# EAGLE schematic atmega32u4_robor (EAGLE 6.3)
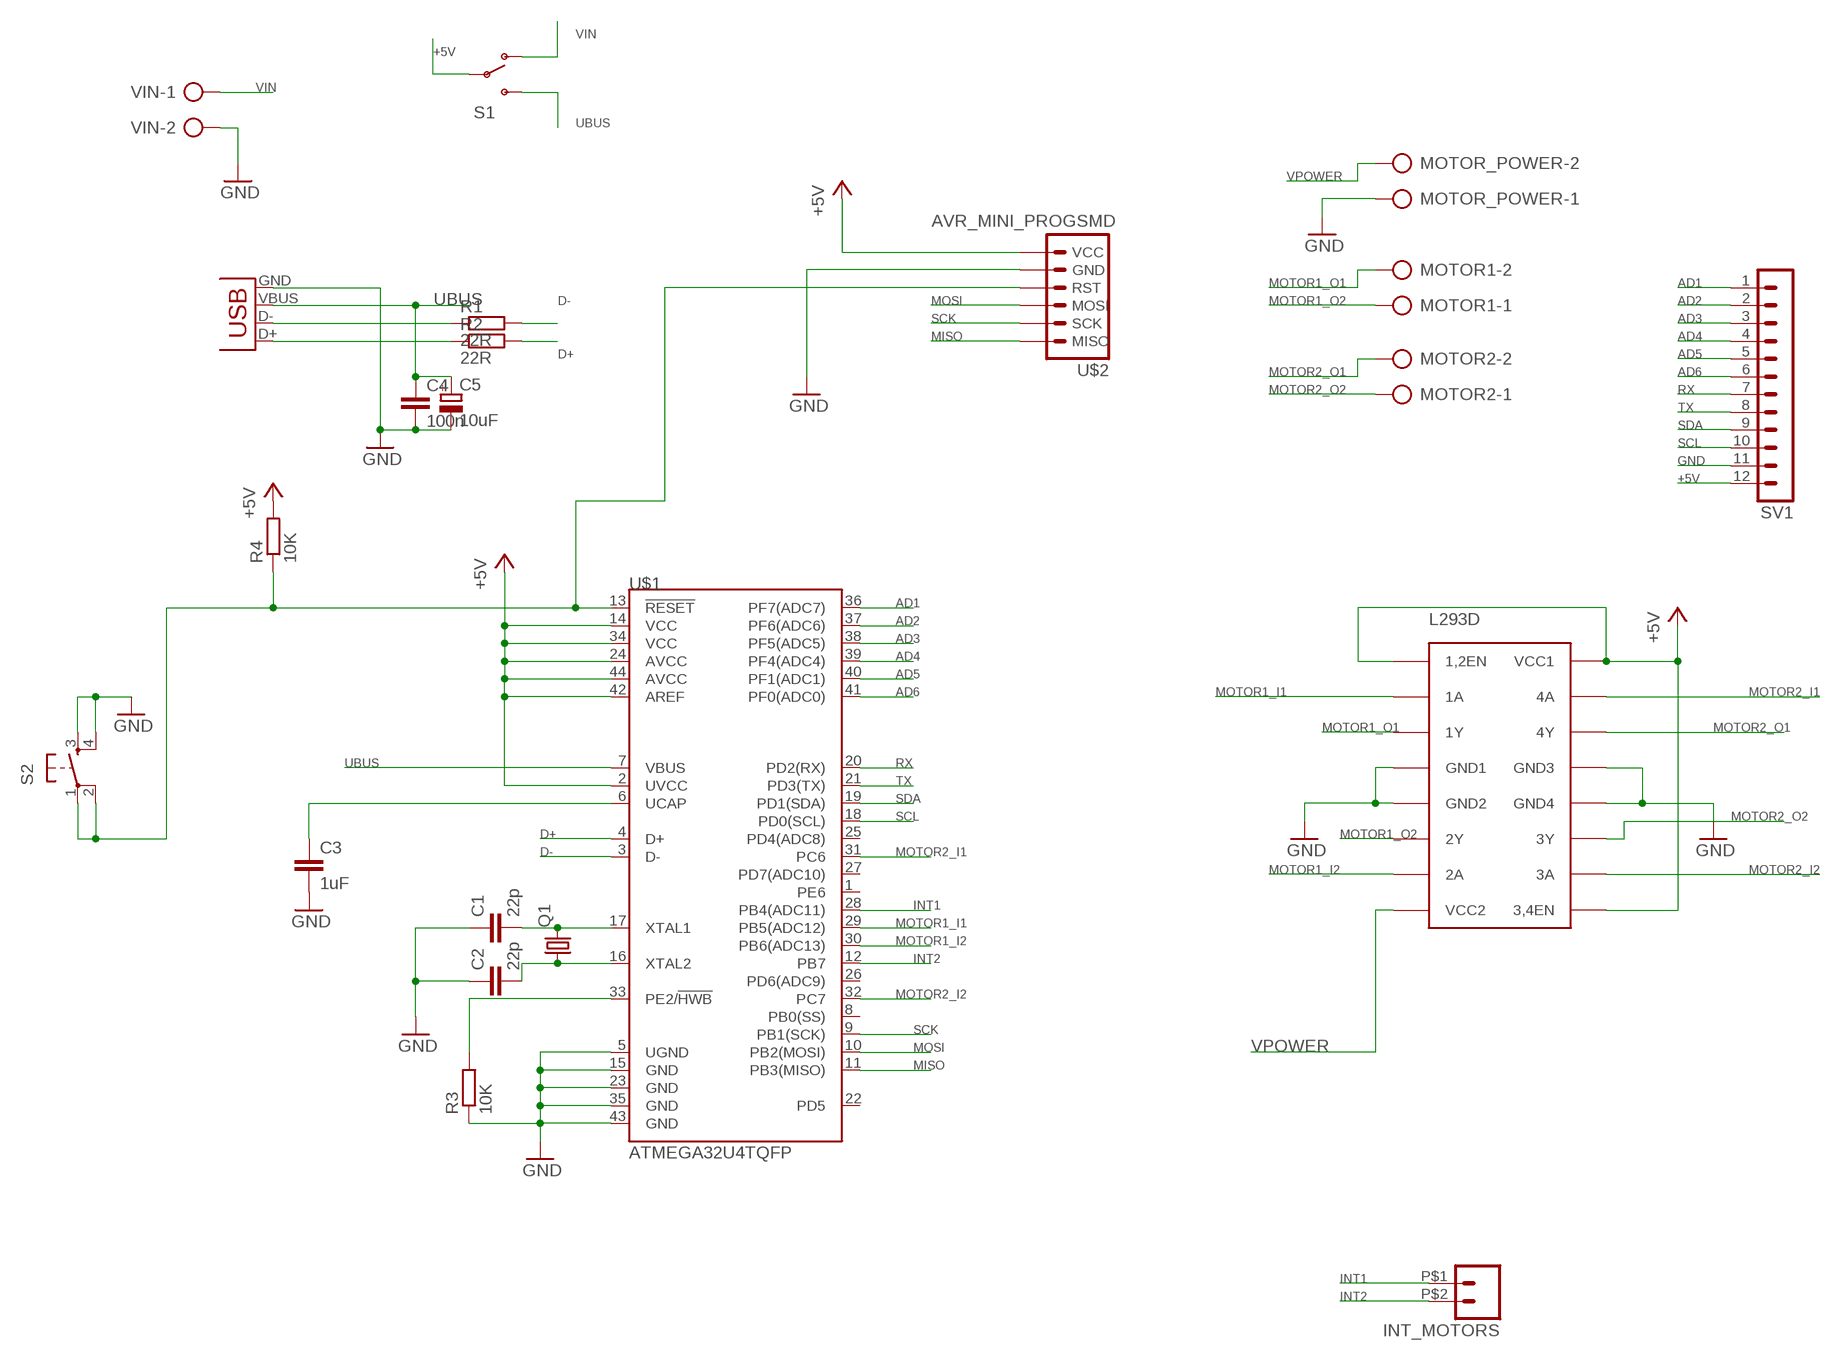
[diagram p0: schematic, sheet 1]

## Parts
C1  22p  C-EUC1206  [C1206]
C2  22p  C-EUC1206  [C1206]
C3  1uF  C-EUC1210  [C1210]
C4  100n  C-EUC1206  [C1206]
C5  10uF  CPOL-EU153CLV-0605  [153CLV-0605]
INT_MOTORS  M02PTH2  [1X02_BIG]
JP1  USB-SMD-NS  [USB-MINIB-NOSTOP]
L293D  L293D  [DIL16]
MOTOR1  AK500/2  [AK500/2]
MOTOR2  AK500/2  [AK500/2]
MOTOR_POWER  AK500/2  [AK500/2]
Q1  CRYSTALHC49UP  [HC49UP]
R1  22R  R-EU_R1206  [R1206]
R2  22R  R-EU_R1206  [R1206]
R3  10K  R-EU_R1206  [R1206]
R4  10K  R-EU_R1206  [R1206]
S1  SWITCH-SPDTPTH_LOCK  [SWITCH-SPDT_LOCK.007S]
S2  TAC_SWITCHSMD  [TACTILE_SWITCH_SMD]
SV1  MA12-1  [MA12-1]
U$1  ATMEGA32U4TQFP  [SPARKFUN-DIGITALIC_TQFP44]
U$2  AVR_MINI_PROGSMD  [AVR_MINI_PROG]
VIN  AK500/2  [AK500/2]

## Nets
+5V: L293D.1(1,2EN) L293D.9(3,4EN) L293D.16(VCC1) R4.2 S1.2(P) SV1.12 U$1.2(UVCC) U$1.14(VCC) U$1.24(AVCC) U$1.34(VCC) U$1.42(AREF) U$1.44(AVCC) U$2.1(VCC)
AD1: SV1.1 U$1.36(PF7(ADC7))
AD2: SV1.2 U$1.37(PF6(ADC6))
AD3: SV1.3 U$1.38(PF5(ADC5))
AD4: SV1.4 U$1.39(PF4(ADC4))
AD5: SV1.5 U$1.40(PF1(ADC1))
AD6: SV1.6 U$1.41(PF0(ADC0))
D+: R2.2 U$1.4(D+)
D-: R1.2 U$1.3(D-)
GND: C1.1 C2.1 C3.2 C4.2 C5.- JP1.GND L293D.4(GND1) L293D.5(GND2) L293D.12(GND4) L293D.13(GND3) MOTOR_POWER.1 R3.1 S2.3 S2.4 SV1.11 U$1.5(UGND) U$1.15(GND) U$1.23(GND) U$1.35(GND) U$1.43(GND) U$2.2(GND) VIN.2
INT1: INT_MOTORS.P$1 U$1.28(PB4(ADC11))
INT2: INT_MOTORS.P$2 U$1.12(PB7)
MISO: U$1.11(PB3(MISO)) U$2.6(MISO)
MOSI: U$1.10(PB2(MOSI))
MOTOR1_I1: L293D.2(1A) U$1.29(PB5(ADC12))
MOTOR1_I2: L293D.7(2A) U$1.30(PB6(ADC13))
MOTOR1_O1: L293D.3(1Y) MOTOR1.2
MOTOR1_O2: L293D.6(2Y) MOTOR1.1
MOTOR2_I1: L293D.15(4A) U$1.31(PC6)
MOTOR2_I2: L293D.10(3A) U$1.32(PC7)
MOTOR2_O1: L293D.14(4Y) MOTOR2.2
MOTOR2_O2: L293D.11(3Y) MOTOR2.1
N$1: C1.2 Q1.2 U$1.17(XTAL1)
N$2: C2.2 Q1.1 U$1.16(XTAL2)
N$3: C3.1 U$1.6(UCAP)
N$4: JP1.D- R1.1
N$5: JP1.D+ R2.1
N$6: R3.2 U$1.33(PE2/!HWB)
N$8: R4.1 S2.1 S2.2 U$1.13(!RESET) U$2.3(RST)
RX: SV1.7 U$1.20(PD2(RX))
SCK: U$1.9(PB1(SCK)) U$2.5(SCK)
SCL: SV1.10 U$1.18(PD0(SCL))
SDA: SV1.9 U$1.19(PD1(SDA))
TX: SV1.8 U$1.21(PD3(TX))
UBUS: C4.1 C5.+ JP1.VBUS S1.3(S) U$1.7(VBUS)
VIN: S1.1(O) VIN.1
VPOWER: L293D.8(VCC2) MOTOR_POWER.2
Unconnected: U$1.1(PE6) U$1.8(PB0(SS)) U$1.22(PD5) U$1.25(PD4(ADC8)) U$1.26(PD6(ADC9)) U$1.27(PD7(ADC10)) U$2.4(MOSI)

## Library data of the parts
C1-C4 = rcl:C-EU: CAPACITOR, European symbol
C5 = rcl:CPOL-EU: POLARIZED CAPACITOR, European symbol
INT_MOTORS = SparkFun-Connectors:M02: Header 2 Standard 2-pin 0.1" header. Use with straight break away headers (SKU : PRT-00116), right angle break away headers (PRT-00553), swiss pins (PRT-00743), machine pins (PRT-00117), and female headers (PRT-00115). Molex polarized connector foot print use with SKU : PRT-08233 with associated crimp pins and housings.
JP1 = SparkFun-Connectors:USB: USB Connectors USB-B-PTH is fully proven SKU : PRT-00139/CONN-08278 USB-miniB is fully proven SKU : PRT-00587 USB-A-PCB is untested. USB-A-H is throughly reviewed, but untested. Spark Fun Electronics SKU : PRT-00437 USB-B-SMT is throughly reviewed, but untested. Needs silkscreen touching up. USB-A-S has not been used/tested USB-MB-H has not been used/tested USB-MICROB has been used. CONN-09505
L293D = sgs-thom:L293D
MOTOR1 MOTOR2 MOTOR_POWER VIN = con-ptr500:AK500/2: CONNECTOR; OC_FARNELL: unknown; OC_NEWARK: unknown
Q1 = crystal:CRYSTAL: CRYSTAL; OC_FARNELL: unknown; OC_NEWARK: unknown
R1-R4 = rcl:R-EU_: RESISTOR, European symbol
S1 = SparkFun-Electromechanical:SWITCH-SPDT: SPDT Switch Simple slide switch, Spark Fun Electronics SKU : COM-00102 DPDT SMT slide switch, AYZ0202, SWCH-08179
S2 = SparkFun-Electromechanical:TAC_SWITCH: Momentary Switch Button commonly used for reset or general input. Spark Fun Electronics SKU : COM-00097 SMT- SWCH-08247; PROD_ID: SWCH-08247
SV1 = con-lstb:MA12-1: PIN HEADER; OC_FARNELL: unknown; OC_NEWARK: unknown
U$1 = SparkFun-DigitalIC:ATMEGA32U4: Atmel 44-pin 8-bit Microcontroller with 32KBytes of ISP Flash and USB Controller
U$2 = SparkFun-Connectors:AVR_MINI_PROG: AVR ISP 6-pin inline header